# EAGLE design axiom_beta_plugin_module_3xPMOD (EAGLE 7.0.0)
Assembly variants: Beta
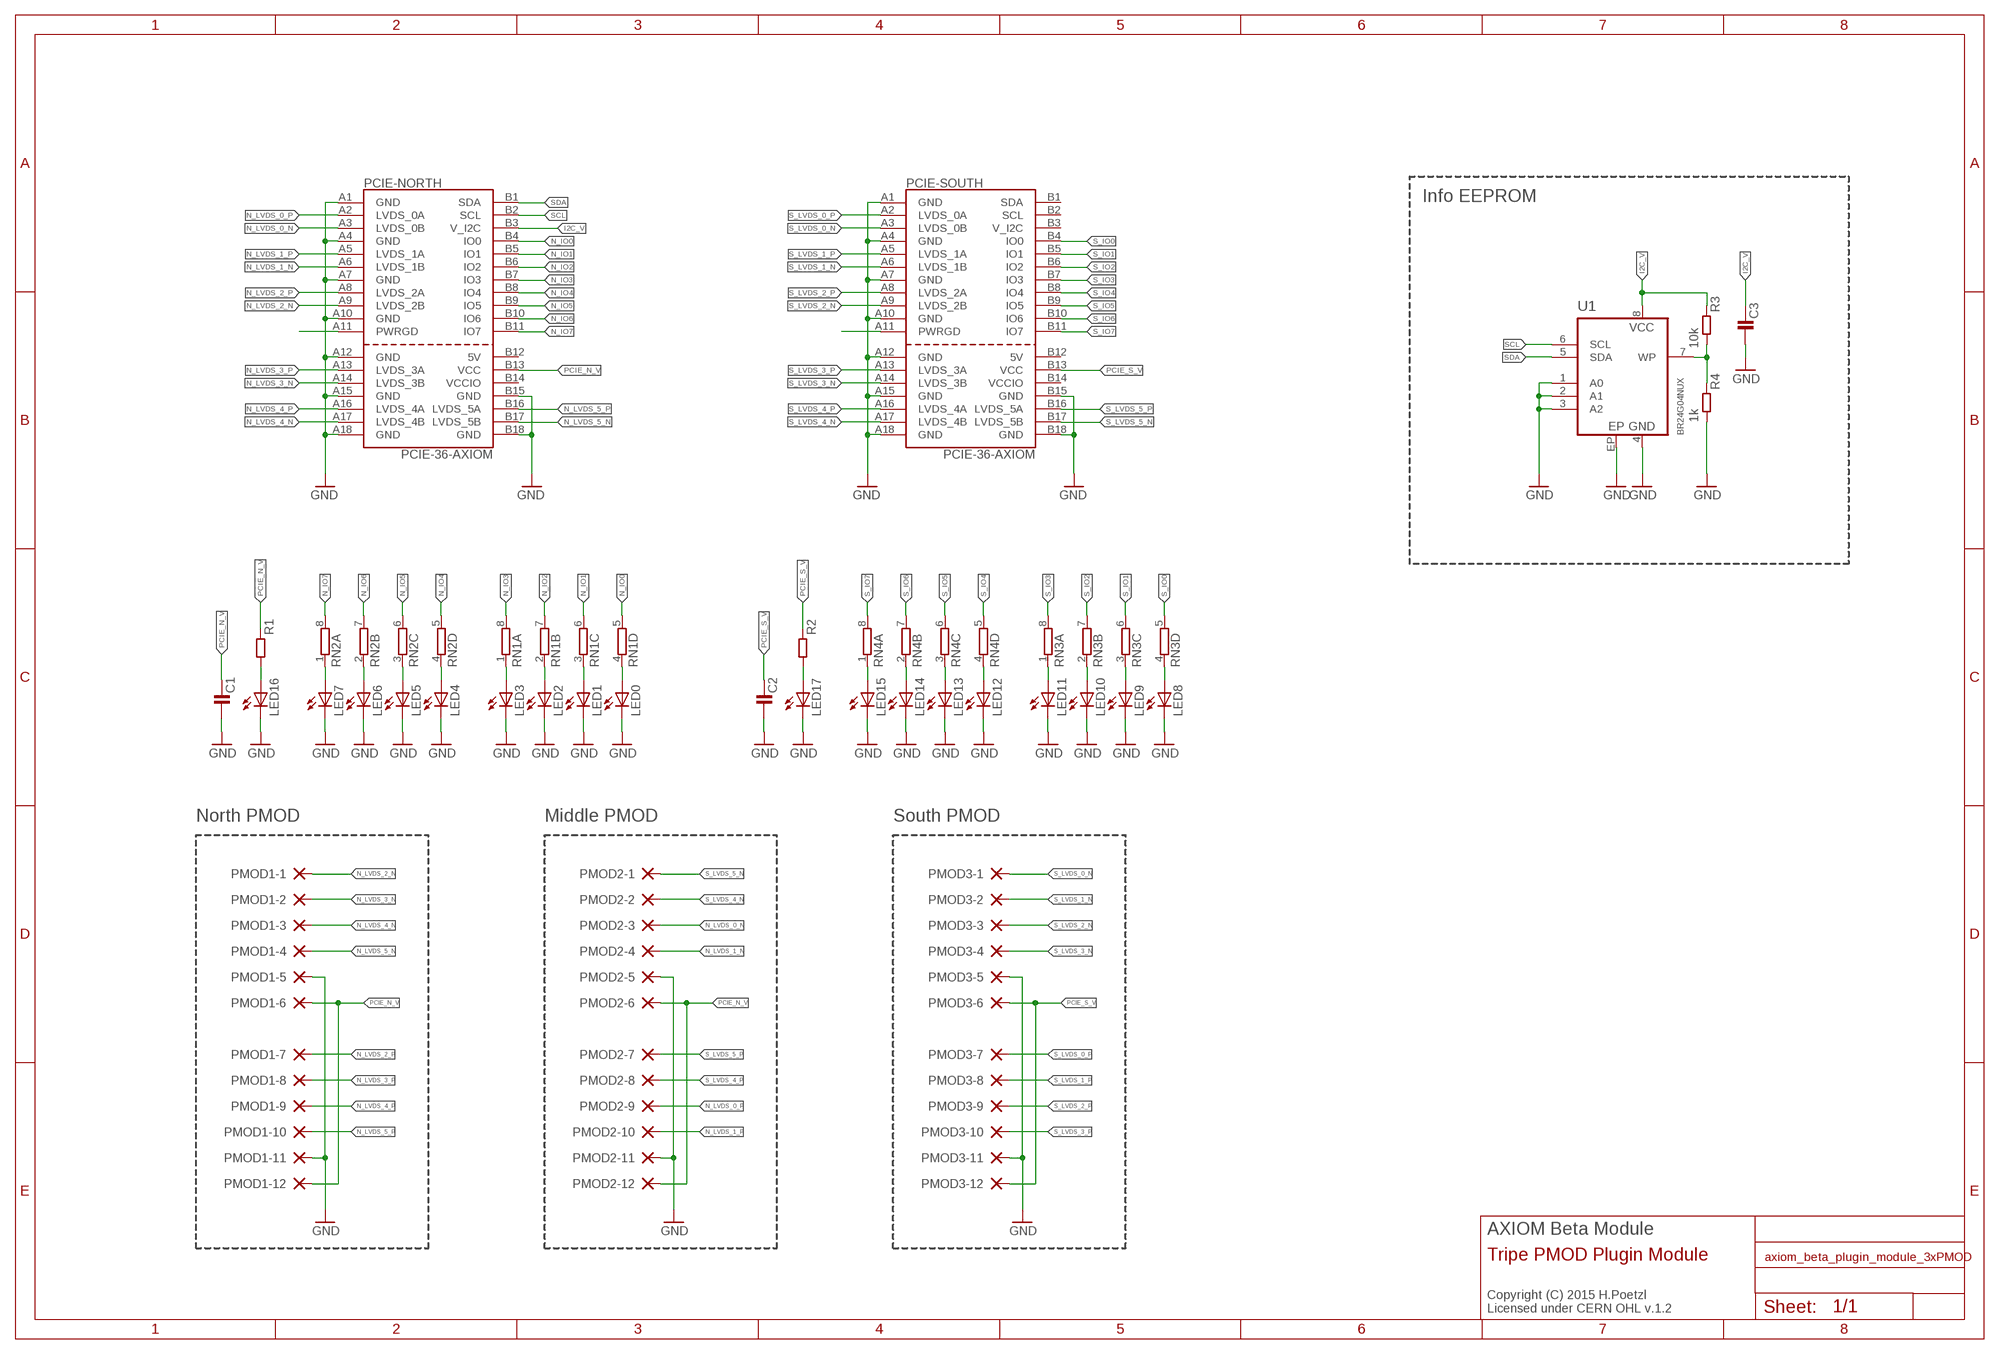
[diagram p0: schematic, sheet 1]

## Parts
C1  C1206-A  [1206-A]
C2  C1206-A  [1206-A]
C3  C0402-B  [0402-B]
LED0  LEDCHIPLED_0603  [CHIPLED_0603]
LED1  LEDCHIPLED_0603  [CHIPLED_0603]
LED2  LEDCHIPLED_0603  [CHIPLED_0603]
LED3  LEDCHIPLED_0603  [CHIPLED_0603]
LED4  LEDCHIPLED_0603  [CHIPLED_0603]
LED5  LEDCHIPLED_0603  [CHIPLED_0603]
LED6  LEDCHIPLED_0603  [CHIPLED_0603]
LED7  LEDCHIPLED_0603  [CHIPLED_0603]
LED8  LEDCHIPLED_0603  [CHIPLED_0603]
LED9  LEDCHIPLED_0603  [CHIPLED_0603]
LED10  LEDCHIPLED_0603  [CHIPLED_0603]
LED11  LEDCHIPLED_0603  [CHIPLED_0603]
LED12  LEDCHIPLED_0603  [CHIPLED_0603]
LED13  LEDCHIPLED_0603  [CHIPLED_0603]
LED14  LEDCHIPLED_0603  [CHIPLED_0603]
LED15  LEDCHIPLED_0603  [CHIPLED_0603]
LED16  LEDCHIPLED_0603  [CHIPLED_0603]
LED17  LEDCHIPLED_0603  [CHIPLED_0603]
PCIE-NORTH  PCIE-36-AXIOM  [PCIE-36-AXIOM]  (not fitted in variant Beta)
PCIE-SOUTH  PCIE-36-AXIOM  [PCIE-36-AXIOM]  (not fitted in variant Beta)
PMOD1-1  SMD-PAD1.6X3.8MM-U  [1.6X3.8U-MM]  (not fitted in variant Beta)
PMOD1-2  SMD-PAD1.6X3.8MM-U  [1.6X3.8U-MM]  (not fitted in variant Beta)
PMOD1-3  SMD-PAD1.6X3.8MM-U  [1.6X3.8U-MM]  (not fitted in variant Beta)
PMOD1-4  SMD-PAD1.6X3.8MM-U  [1.6X3.8U-MM]  (not fitted in variant Beta)
PMOD1-5  SMD-PAD1.6X3.8MM-U  [1.6X3.8U-MM]  (not fitted in variant Beta)
PMOD1-6  SMD-PAD1.6X3.8MM-U  [1.6X3.8U-MM]  (not fitted in variant Beta)
PMOD1-7  SMD-PAD1.6X3.8MM-U  [1.6X3.8U-MM]  (not fitted in variant Beta)
PMOD1-8  SMD-PAD1.6X3.8MM-U  [1.6X3.8U-MM]  (not fitted in variant Beta)
PMOD1-9  SMD-PAD1.6X3.8MM-U  [1.6X3.8U-MM]  (not fitted in variant Beta)
PMOD1-10  SMD-PAD1.6X3.8MM-U  [1.6X3.8U-MM]  (not fitted in variant Beta)
PMOD1-11  SMD-PAD1.6X3.8MM-U  [1.6X3.8U-MM]  (not fitted in variant Beta)
PMOD1-12  SMD-PAD1.6X3.8MM-U  [1.6X3.8U-MM]  (not fitted in variant Beta)
PMOD2-1  SMD-PAD1.6X3.8MM-U  [1.6X3.8U-MM]  (not fitted in variant Beta)
PMOD2-2  SMD-PAD1.6X3.8MM-U  [1.6X3.8U-MM]  (not fitted in variant Beta)
PMOD2-3  SMD-PAD1.6X3.8MM-U  [1.6X3.8U-MM]  (not fitted in variant Beta)
PMOD2-4  SMD-PAD1.6X3.8MM-U  [1.6X3.8U-MM]  (not fitted in variant Beta)
PMOD2-5  SMD-PAD1.6X3.8MM-U  [1.6X3.8U-MM]  (not fitted in variant Beta)
PMOD2-6  SMD-PAD1.6X3.8MM-U  [1.6X3.8U-MM]  (not fitted in variant Beta)
PMOD2-7  SMD-PAD1.6X3.8MM-U  [1.6X3.8U-MM]  (not fitted in variant Beta)
PMOD2-8  SMD-PAD1.6X3.8MM-U  [1.6X3.8U-MM]  (not fitted in variant Beta)
PMOD2-9  SMD-PAD1.6X3.8MM-U  [1.6X3.8U-MM]  (not fitted in variant Beta)
PMOD2-10  SMD-PAD1.6X3.8MM-U  [1.6X3.8U-MM]  (not fitted in variant Beta)
PMOD2-11  SMD-PAD1.6X3.8MM-U  [1.6X3.8U-MM]  (not fitted in variant Beta)
PMOD2-12  SMD-PAD1.6X3.8MM-U  [1.6X3.8U-MM]  (not fitted in variant Beta)
PMOD3-1  SMD-PAD1.6X3.8MM-U  [1.6X3.8U-MM]  (not fitted in variant Beta)
PMOD3-2  SMD-PAD1.6X3.8MM-U  [1.6X3.8U-MM]  (not fitted in variant Beta)
PMOD3-3  SMD-PAD1.6X3.8MM-U  [1.6X3.8U-MM]  (not fitted in variant Beta)
PMOD3-4  SMD-PAD1.6X3.8MM-U  [1.6X3.8U-MM]  (not fitted in variant Beta)
PMOD3-5  SMD-PAD1.6X3.8MM-U  [1.6X3.8U-MM]  (not fitted in variant Beta)
PMOD3-6  SMD-PAD1.6X3.8MM-U  [1.6X3.8U-MM]  (not fitted in variant Beta)
PMOD3-7  SMD-PAD1.6X3.8MM-U  [1.6X3.8U-MM]  (not fitted in variant Beta)
PMOD3-8  SMD-PAD1.6X3.8MM-U  [1.6X3.8U-MM]  (not fitted in variant Beta)
PMOD3-9  SMD-PAD1.6X3.8MM-U  [1.6X3.8U-MM]  (not fitted in variant Beta)
PMOD3-10  SMD-PAD1.6X3.8MM-U  [1.6X3.8U-MM]  (not fitted in variant Beta)
PMOD3-11  SMD-PAD1.6X3.8MM-U  [1.6X3.8U-MM]  (not fitted in variant Beta)
PMOD3-12  SMD-PAD1.6X3.8MM-U  [1.6X3.8U-MM]  (not fitted in variant Beta)
R1  R0402-B  [0402-B]
R2  R0402-B  [0402-B]
R3  10k  R0402-B  [0402-B]
R4  1k  R0402-B  [0402-B]
RN1  4R-NCAY16  [CAY16]
RN2  4R-NCAY16  [CAY16]
RN3  4R-NCAY16  [CAY16]
RN4  4R-NCAY16  [CAY16]
U1  BR24G04NUX  [DFN200X300X100-9N]

## Nets
GND: C1.2 C2.2 C3.2 LED0.C LED1.C LED2.C LED3.C LED4.C LED5.C LED6.C LED7.C LED8.C LED9.C LED10.C LED11.C LED12.C LED13.C LED14.C LED15.C LED16.C LED17.C PCIE-NORTH.A1(GND) PCIE-NORTH.A4(GND) PCIE-NORTH.A7(GND) PCIE-NORTH.A10(GND) PCIE-NORTH.A12(GND) PCIE-NORTH.A15(GND) PCIE-NORTH.A18(GND) PCIE-NORTH.B15(GND) PCIE-NORTH.B18(GND) PCIE-SOUTH.A1(GND) PCIE-SOUTH.A4(GND) PCIE-SOUTH.A7(GND) PCIE-SOUTH.A10(GND) PCIE-SOUTH.A12(GND) PCIE-SOUTH.A15(GND) PCIE-SOUTH.A18(GND) PCIE-SOUTH.B15(GND) PCIE-SOUTH.B18(GND) PMOD1-5.1(P) PMOD1-11.1(P) PMOD2-5.1(P) PMOD2-11.1(P) PMOD3-5.1(P) PMOD3-11.1(P) R4.2 U1.1(A0) U1.2(A1) U1.3(A2) U1.4(GND) U1.EP
I2C_V: C3.1 PCIE-NORTH.B3(V_I2C) R3.1 U1.8(VCC)
N$196: LED3.A RN1.1
N$197: LED2.A RN1.2
N$198: LED1.A RN1.3
N$202: LED0.A RN1.4
N$209: PCIE-NORTH.A11(PWRGD)
N$211: LED16.A R1.2
N$214: LED17.A R2.2
N$216: R3.2 R4.1 U1.7(WP)
N$256: PCIE-SOUTH.A11(PWRGD)
N$275: LED7.A RN2.1
N$276: LED6.A RN2.2
N$277: LED5.A RN2.3
N$278: LED4.A RN2.4
N$322: LED11.A RN3.1
N$323: LED10.A RN3.2
N$324: LED9.A RN3.3
N$325: LED8.A RN3.4
N$369: LED15.A RN4.1
N$370: LED14.A RN4.2
N$371: LED13.A RN4.3
N$372: LED12.A RN4.4
N_IO0: PCIE-NORTH.B4(IO0) RN1.5
N_IO1: PCIE-NORTH.B5(IO1) RN1.6
N_IO2: PCIE-NORTH.B6(IO2) RN1.7
N_IO3: PCIE-NORTH.B7(IO3) RN1.8
N_IO4: PCIE-NORTH.B8(IO4) RN2.5
N_IO5: PCIE-NORTH.B9(IO5) RN2.6
N_IO6: PCIE-NORTH.B10(IO6) RN2.7
N_IO7: PCIE-NORTH.B11(IO7) RN2.8
N_LVDS_0_N: PCIE-NORTH.A3(LVDS_0B) PMOD2-3.1(P)
N_LVDS_0_P: PCIE-NORTH.A2(LVDS_0A) PMOD2-9.1(P)
N_LVDS_1_N [LVDS]: PCIE-NORTH.A6(LVDS_1B) PMOD2-4.1(P)
N_LVDS_1_P [LVDS]: PCIE-NORTH.A5(LVDS_1A) PMOD2-10.1(P)
N_LVDS_2_N [LVDS]: PCIE-NORTH.A9(LVDS_2B) PMOD1-1.1(P)
N_LVDS_2_P [LVDS]: PCIE-NORTH.A8(LVDS_2A) PMOD1-7.1(P)
N_LVDS_3_N: PCIE-NORTH.A14(LVDS_3B) PMOD1-2.1(P)
N_LVDS_3_P: PCIE-NORTH.A13(LVDS_3A) PMOD1-8.1(P)
N_LVDS_4_N [LVDS]: PCIE-NORTH.A17(LVDS_4B) PMOD1-3.1(P)
N_LVDS_4_P [LVDS]: PCIE-NORTH.A16(LVDS_4A) PMOD1-9.1(P)
N_LVDS_5_N [LVDS]: PCIE-NORTH.B17(LVDS_5B) PMOD1-4.1(P)
N_LVDS_5_P [LVDS]: PCIE-NORTH.B16(LVDS_5A) PMOD1-10.1(P)
PCIE_N_V: C1.1 PCIE-NORTH.B13(VCC) PMOD1-6.1(P) PMOD1-12.1(P) PMOD2-6.1(P) PMOD2-12.1(P) R1.1
PCIE_S_V: C2.1 PCIE-SOUTH.B13(VCC) PMOD3-6.1(P) PMOD3-12.1(P) R2.1
S_IO0: PCIE-SOUTH.B4(IO0) RN3.5
S_IO1: PCIE-SOUTH.B5(IO1) RN3.6
S_IO2: PCIE-SOUTH.B6(IO2) RN3.7
S_IO3: PCIE-SOUTH.B7(IO3) RN3.8
S_IO4: PCIE-SOUTH.B8(IO4) RN4.5
S_IO5: PCIE-SOUTH.B9(IO5) RN4.6
S_IO6: PCIE-SOUTH.B10(IO6) RN4.7
S_IO7: PCIE-SOUTH.B11(IO7) RN4.8
S_LVDS_0_N [LVDS]: PCIE-SOUTH.A3(LVDS_0B) PMOD3-1.1(P)
S_LVDS_0_P [LVDS]: PCIE-SOUTH.A2(LVDS_0A) PMOD3-7.1(P)
S_LVDS_1_N: PCIE-SOUTH.A6(LVDS_1B) PMOD3-2.1(P)
S_LVDS_1_P: PCIE-SOUTH.A5(LVDS_1A) PMOD3-8.1(P)
S_LVDS_2_N [LVDS]: PCIE-SOUTH.A9(LVDS_2B) PMOD3-3.1(P)
S_LVDS_2_P [LVDS]: PCIE-SOUTH.A8(LVDS_2A) PMOD3-9.1(P)
S_LVDS_3_N [LVDS]: PCIE-SOUTH.A14(LVDS_3B) PMOD3-4.1(P)
S_LVDS_3_P [LVDS]: PCIE-SOUTH.A13(LVDS_3A) PMOD3-10.1(P)
S_LVDS_4_N [LVDS]: PCIE-SOUTH.A17(LVDS_4B) PMOD2-2.1(P)
S_LVDS_4_P [LVDS]: PCIE-SOUTH.A16(LVDS_4A) PMOD2-8.1(P)
S_LVDS_5_N [LVDS]: PCIE-SOUTH.B17(LVDS_5B) PMOD2-1.1(P)
S_LVDS_5_P [LVDS]: PCIE-SOUTH.B16(LVDS_5A) PMOD2-7.1(P)
SCL: PCIE-NORTH.B2(SCL) U1.6(SCL)
SDA: PCIE-NORTH.B1(SDA) U1.5(SDA)
Unconnected: PCIE-NORTH.B12(5V) PCIE-NORTH.B14(VCCIO) PCIE-SOUTH.B1(SDA) PCIE-SOUTH.B2(SCL) PCIE-SOUTH.B3(V_I2C) PCIE-SOUTH.B12(5V) PCIE-SOUTH.B14(VCCIO)

## Notes on the sheet
- Info EEPROM
- North PMOD | Middle PMOD | South PMOD
- AXIOM Beta Module
- Tripe PMOD Plugin Module
- Copyright (C) 2015 H.Poetzl
  Licensed under CERN OHL v.1.2

## Library data of the parts
C1-C3 = generic-rcl:C
LED0 LED1-LED17 = led:LED: LED OSRAM: - CHIPLED LG R971, LG N971, LY N971, LG Q971, LY Q971, LO R971, LY R971 LH N974, LH R974 LS Q976, LO Q976, LY Q976 LO Q996 - Hyper CHIPLED LW Q18S LB Q993, LB Q99A, LB R99A - SideLED LS A670, LO A670, LY A670, LG A670, LP A670 LB A673, LV A673, LT A673, LW A673 LH A674 LY A675 LS A676, LA A676, LO A676, LY A676, LW A676 LS A679, LY A679, LG A679 - Hyper Micro SIDELED® LS Y876, LA Y876, LO Y876, LY Y876 LT Y87S - SmartLED LW L88C, LW L88S LB L89C, LB L89S, LG L890 LS L89K, LO L89K, LY L89K LS L896, LA L896, LO L896, LY L896 - TOPLED LS T670, LO T670, LY T670, LG T670, LP T670 LSG T670, LSP T670, LSY T670, LOP T670, LYG T670 LG T671, LOG T671, LSG T671 LB T673, LV T673, LT T673, LW T673 LH T674 LS T676, LA T676, LO T676, LY T676, LB T676, LH T676, LSB T676, LW T676 LB T67C, LV T67C, LT T67C, LS T67K, LO T67K, LY T67K, LW E67C LS E67B, LA E67B, LO E67B, LY E67B, LB E67C, LV E67C, LT E67C LW T67C LS T679, LY T679, LG T679 LS T770, LO T770, LY T770, LG T770, LP T770 LB T773, LV T773, LT T773, LW T773 LH T774 LS E675, LA E675, LY E675, LS T675 LS T776, LA T776, LO T776, LY T776, LB T776 LHGB T686 LT T68C, LB T68C - Hyper Mini TOPLED® LB M676 - Mini TOPLED Santana® LG M470 LS M47K, LO M47K, LY M47K Source: http://www.osram.convergy.de LUXEON: - LUMILED® LXK2-PW12-R00, LXK2-PW12-S00, LXK2-PW14-U00, LXK2-PW14-V00 LXK2-PM12-R00, LXK2-PM12-S00, LXK2-PM14-U00 LXK2-PE12-Q00, LXK2-PE12-R00, LXK2-PE12-S00, LXK2-PE14-T00, LXK2-PE14-U00 LXK2-PB12-K00, LXK2-PB12-L00, LXK2-PB12-M00, LXK2-PB14-N00, LXK2-PB14-P00, LXK2-PB14-Q00 LXK2-PR12-L00, LXK2-PR12-M00, LXK2-PR14-Q00, LXK2-PR14-R00 LXK2-PD12-Q00, LXK2-PD12-R00, LXK2-PD12-S00 LXK2-PH12-R00, LXK2-PH12-S00 LXK2-PL12-P00, LXK2-PL12-Q00, LXK2-PL12-R00 Source: www.luxeon.com KINGBRIGHT: KA-3528ASYC Source: www.kingbright.com
PCIE-NORTH PCIE-SOUTH = PCIe:PCIE-36-AXIOM
PMOD1-1-PMOD1-12 PMOD2-1-PMOD2-12 PMOD3-1-PMOD3-12 = smd_pads:SMD-PAD: SMD PAD
R1-R4 = generic-rcl:R
RN1-RN4 = resistor-dil:4R-N: Array Chip Resistor Source: RS Component / Phycomp; OC_FARNELL: unknown; OC_NEWARK: unknown
U1 = eeprom:BR24G04

## Net classes
0 default: width 0.152 mm, drill 0.254 mm, clearance 0.152 mm
1 LVDS: width 0.152 mm, drill 0.254 mm, clearance 0.152 mm

## Board
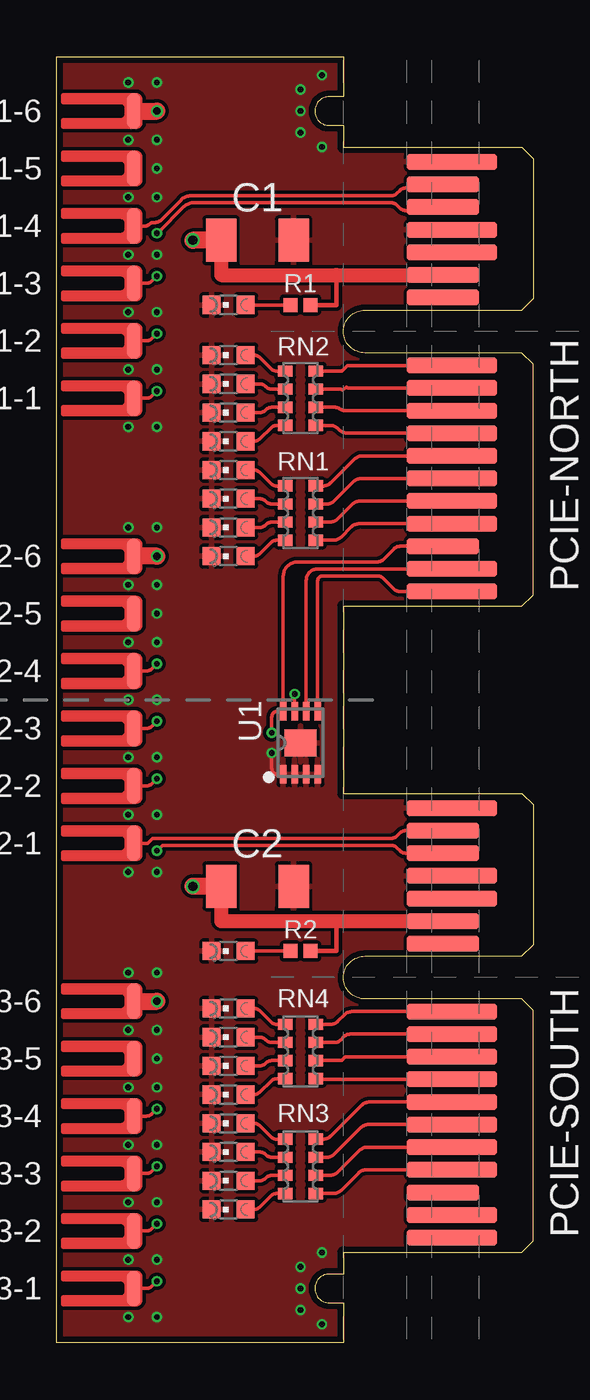
[diagram p1: board, top side]
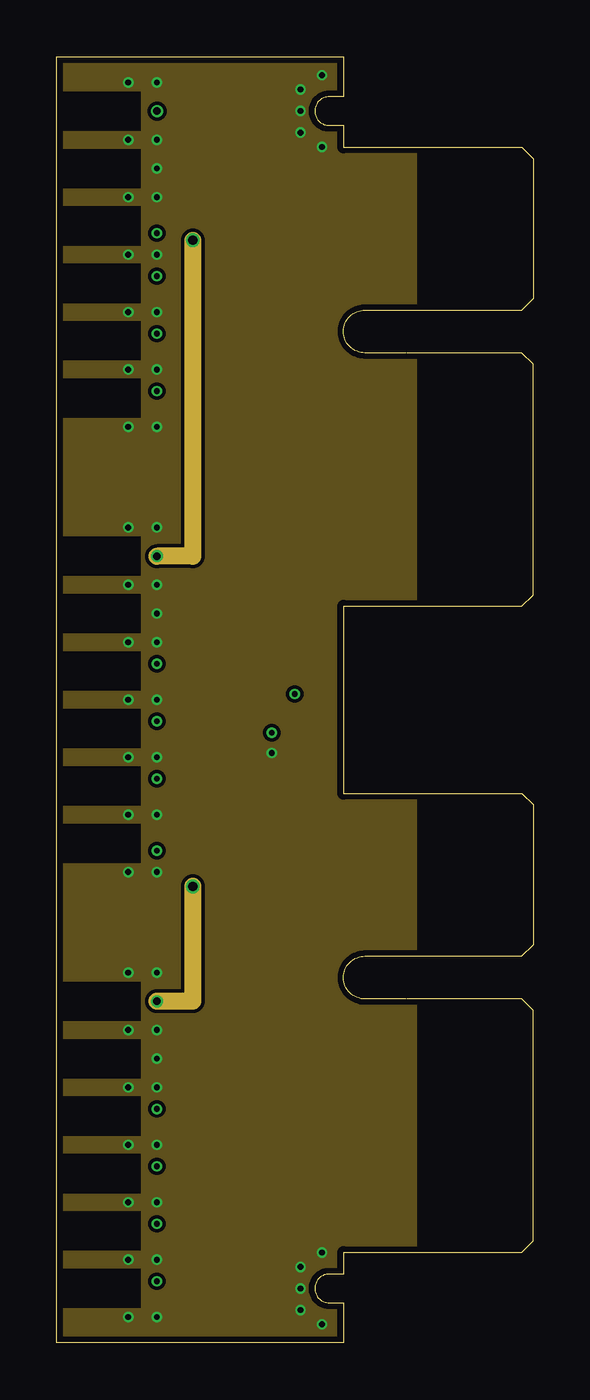
[diagram p2: board, inner layer Route2]
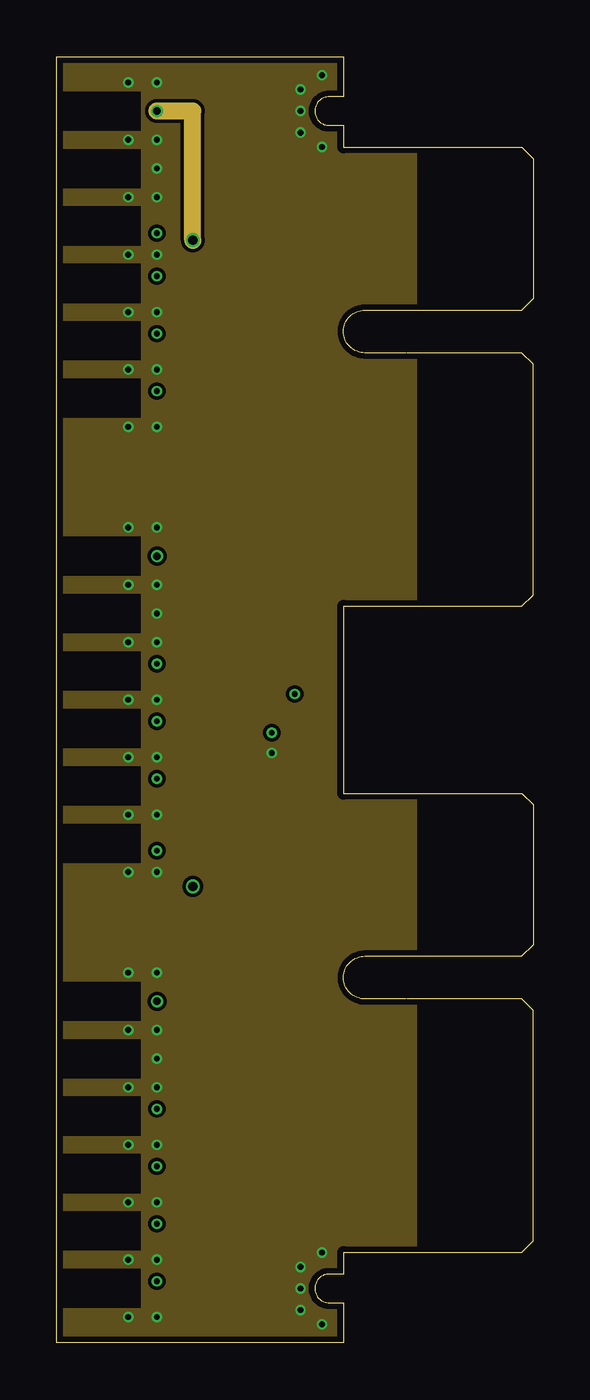
[diagram p3: board, inner layer Route15]
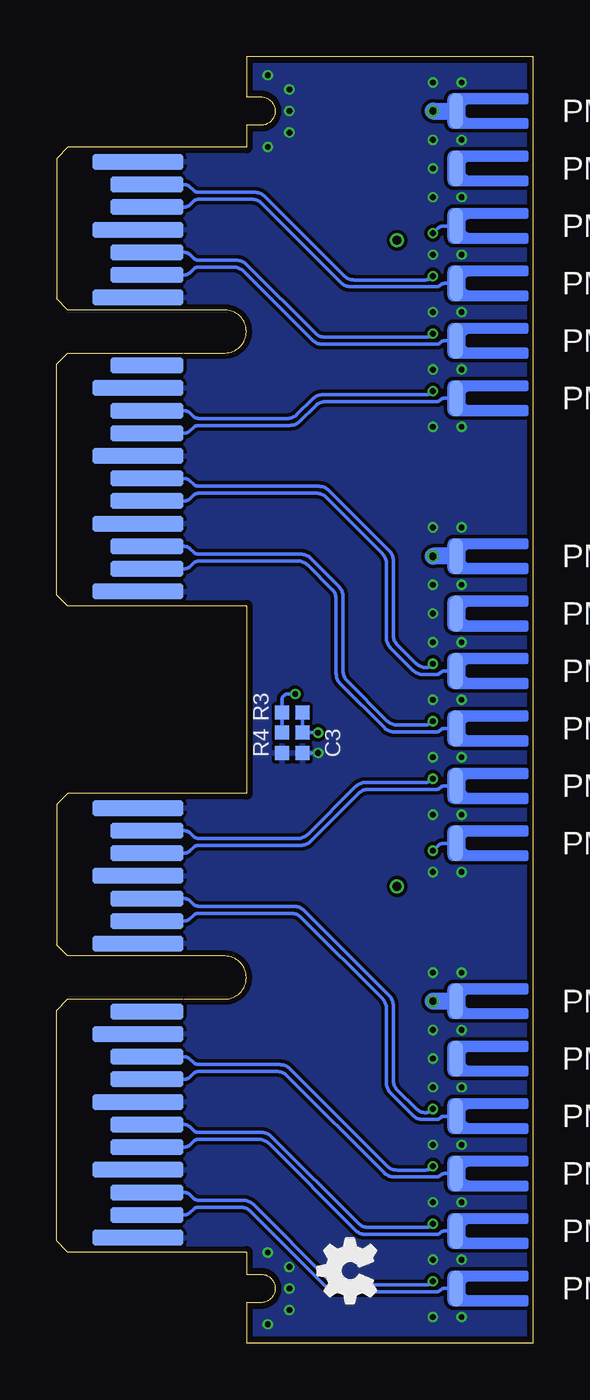
[diagram p4: board, bottom side, seen from below]

Size 21.1 x 56.9 mm. Coordinates in mm from the lower left corner, seen from the top.
Outline: 12.7,32.59 12.7,24.31
Outline: 0,18.92 0,37.97
Outline: 12.7,52.89 12.7,53.85 12.06,53.85 arc-90 11.43,54.48 arc-90 12.06,55.12 12.7,55.12 12.7,56.9 0,56.9 0,0 12.7,0 12.7,1.78 12.06,1.78 arc-90 11.43,2.41 arc-90 12.06,3.05 12.7,3.05 12.7,4.01
Copper layers (1*2*15*16): Top 0.035559375mm / dielectric 0.17018125mm / Route2 0.01778125mm / dielectric 47mil / Route15 0.01778125mm / dielectric 0.17018125mm / Bottom 0.035559375mm
Design rules "OSHPark-4layer-tuned *": minimum track width 5mil, minimum drill 10mil, track to track 6mil, track to pad 5mil, pad to pad 5mil, via to via 5mil, smd to smd 5mil, copper to edge 10mil, drill to drill 6mil, minimum pad ring 4mil, minimum via ring 4mil, stop-mask expansion 2mil, vias tented up to drill 16mil, thermal gap 6mil
tKeepout: area 10.5,52.9 to 13.7,56.1; area 10.5,0.8 to 13.7,4
bKeepout: area 10.5,52.9 to 13.7,56.1; area 10.5,0.8 to 13.7,4

### Footprints (pad centres in the part's own frame; a part is rotated, then mirrored left to right if it is on the bottom)
1206-A = smd 1.35 x 1.9: 1 -1.6,0; 2 1.6,0
0402-B = smd 0.62 x 0.62: 1 -0.45,0; 2 0.45,0
CHIPLED_0603 = smd 0.8 x 0.8: A 0,-0.75; C 0,0.75
PCIE-36-AXIOM = smd 0.7 x 4 bottom: A1 -11.5,3.6; A4 -8.5,3.6; A7 -5.5,3.6; A10 -2.5,3.6; A12 1.5,3.6; A15 4.5,3.6; A18 7.5,3.6 | smd 0.7 x 3.2 bottom: A2 -10.5,4; A3 -9.5,4; A5 -7.5,4; A6 -6.5,4; A8 -4.5,4; A9 -3.5,4; A11 -1.5,4; A13 2.5,4; A14 3.5,4; A16 5.5,4; A17 6.5,4 | smd 0.7 x 4: B1 -11.5,3.6; B2 -10.5,3.6; B4 -8.5,3.6; B5 -7.5,3.6; B6 -6.5,3.6; B7 -5.5,3.6; B8 -4.5,3.6; B9 -3.5,3.6; B10 -2.5,3.6; B11 -1.5,3.6; B14 3.5,3.6; B15 4.5,3.6; B18 7.5,3.6 | smd 0.7 x 3.2: B3 -9.5,4; B12 1.5,4; B13 2.5,4; B16 5.5,4; B17 6.5,4
1.6X3.8U-MM = smd 1.6 x 0.6: 1 0,-1.5
CAY16 = smd 0.5 x 0.65: 1 -1.2,-0.675; 2 -0.4,-0.675; 3 0.4,-0.675; 4 1.2,-0.675; 5 1.2,0.675; 6 0.4,0.675; 7 -0.4,0.675; 8 -1.2,0.675
DFN200X300X100-9N = smd 0.813 x 0.305: 1 -1.397,0.762; 2 -1.397,0.254; 3 -1.397,-0.254; 4 -1.397,-0.762; 5 1.397,-0.762; 6 1.397,-0.254; 7 1.397,0.254; 8 1.397,0.762 | smd 1.194 x 1.397: EP 0,0

### Placement (x,y rotation side)
C1  8.89,48.77 0 top
C2  8.89,20.19 0 top
C3  10.22,26.54 270 bottom
LED0  7.62,34.8 90 top
LED1  7.62,36.07 90 top
LED2  7.62,37.34 90 top
LED3  7.62,38.61 90 top
LED4  7.62,39.88 90 top
LED5  7.62,41.15 90 top
LED6  7.62,42.42 90 top
LED7  7.62,43.69 90 top
LED8  7.62,5.91 90 top
LED9  7.62,7.18 90 top
LED10  7.62,8.45 90 top
LED11  7.62,9.72 90 top
LED12  7.62,10.99 90 top
LED13  7.62,12.26 90 top
LED14  7.62,13.53 90 top
LED15  7.62,14.8 90 top
LED16  7.62,45.91 90 top
LED17  7.62,17.34 90 top
LOGO1  OSHW_LOGO_FILLX0100-NT  [OSHW_FILLX100_NOTEXT]  6.98,1.78 90 bottom
PCIE-NORTH  21.1,44.74 90 top  (not fitted)
PCIE-SOUTH  21.1,16.16 90 top  (not fitted)
PMOD1-1  1.9,41.78 90 top  (not fitted)
PMOD1-2  1.9,44.32 90 top  (not fitted)
PMOD1-3  1.9,46.86 90 top  (not fitted)
PMOD1-4  1.9,49.4 90 top  (not fitted)
PMOD1-5  1.9,51.94 90 top  (not fitted)
PMOD1-6  1.9,54.48 90 top  (not fitted)
PMOD1-7  1.9,41.78 270 bottom  (not fitted)
PMOD1-8  1.9,44.32 270 bottom  (not fitted)
PMOD1-9  1.9,46.86 270 bottom  (not fitted)
PMOD1-10  1.9,49.4 270 bottom  (not fitted)
PMOD1-11  1.9,51.94 270 bottom  (not fitted)
PMOD1-12  1.9,54.48 270 bottom  (not fitted)
PMOD2-1  1.9,22.1 90 top  (not fitted)
PMOD2-2  1.9,24.64 90 top  (not fitted)
PMOD2-3  1.9,27.18 90 top  (not fitted)
PMOD2-4  1.9,29.72 90 top  (not fitted)
PMOD2-5  1.9,32.26 90 top  (not fitted)
PMOD2-6  1.9,34.8 90 top  (not fitted)
PMOD2-7  1.9,22.1 270 bottom  (not fitted)
PMOD2-8  1.9,24.64 270 bottom  (not fitted)
PMOD2-9  1.9,27.18 270 bottom  (not fitted)
PMOD2-10  1.9,29.72 270 bottom  (not fitted)
PMOD2-11  1.9,32.26 270 bottom  (not fitted)
PMOD2-12  1.9,34.8 270 bottom  (not fitted)
PMOD3-1  1.9,2.41 90 top  (not fitted)
PMOD3-2  1.9,4.95 90 top  (not fitted)
PMOD3-3  1.9,7.49 90 top  (not fitted)
PMOD3-4  1.9,10.03 90 top  (not fitted)
PMOD3-5  1.9,12.57 90 top  (not fitted)
PMOD3-6  1.9,15.11 90 top  (not fitted)
PMOD3-7  1.9,2.41 270 bottom  (not fitted)
PMOD3-8  1.9,4.95 270 bottom  (not fitted)
PMOD3-9  1.9,7.49 270 bottom  (not fitted)
PMOD3-10  1.9,10.03 270 bottom  (not fitted)
PMOD3-11  1.9,12.57 270 bottom  (not fitted)
PMOD3-12  1.9,15.11 270 bottom  (not fitted)
R1  10.79,45.91 180 top
R2  10.79,17.34 180 top
R3  10.67,27.88 180 bottom
R4  11.11,26.54 270 bottom
RN1  10.79,36.7 270 top
RN2  10.79,41.78 270 top
RN3  10.79,7.81 270 top
RN4  10.79,12.89 270 top
U1  10.79,26.54 90 top

### Tracks (layer width: path | path; a pad name or v marks a point on that pad's centre or on a via)
GND  (via drill 0.25)
  Top 0.152: U1.1 9.78,25.15 arc-90 9.52,25.4 v9.52,26.09
  Bottom 0.152: v9.52,26.09 C3.2
  other vias: 4.44,23.37 4.44,25.91 4.44,20.83 4.44,28.45 4.44,30.99 4.44,32.26 4.44,33.53 4.44,36.07 3.17,23.37 3.17,20.83 3.17,25.91 3.17,28.45 3.17,30.99 3.17,33.53 3.17,36.07 4.44,3.68 4.44,6.22 4.44,1.14 4.44,8.76 4.44,11.3 4.44,12.57 4.44,13.84 4.44,16.38 3.17,3.68 3.17,1.14 3.17,6.22 3.17,8.76 3.17,11.3 3.17,13.84 3.17,16.38 4.44,43.05 4.44,45.59 4.44,40.51 4.44,48.13 4.44,50.67 4.44,51.94 4.44,53.21 4.44,55.75 3.17,43.05 3.17,40.51 3.17,45.59 3.17,48.13 3.17,50.67 3.17,53.21 3.17,55.75 11.75,0.83 10.79,1.46 10.79,2.41 10.79,3.37 11.75,4 11.75,56.07 11.75,52.9 10.79,53.53 10.79,55.44 10.79,54.48
  pour Top (isolate 0.152): 0,56.9 12.7,56.9 12.7,53.21 15.88,53.21 15.88,3.68 12.7,3.68 12.7,0 0,0
  pour Bottom (isolate 0.152): 0,56.9 12.7,56.9 12.7,53.21 15.88,53.21 15.88,3.68 12.7,3.68 12.7,0 0,0
  pour Route2 (isolate 0.152): 0,56.9 12.7,56.9 12.7,53.21 15.88,53.21 15.88,3.68 12.7,3.68 12.7,0 0,0 0,1.46 3.81,1.46 3.81,3.37 0,3.37 0,4 3.81,4 3.81,5.91 0,5.91 0,6.54 3.81,6.54 3.81,8.45 0,8.45 0,9.08 3.81,9.08 3.81,10.99 0,10.99 0,11.62 3.81,11.62 3.81,13.53 0,13.53 0,14.16 3.81,14.16 3.81,16.07 0,16.07 0,21.15 3.81,21.15 3.81,23.05 0,23.05 0,23.69 3.81,23.69 3.81,25.59 0,25.59 0,26.23 3.81,26.23 3.81,28.13 0,28.13 0,28.77 3.81,28.77 3.81,30.67 0,30.67 0,31.31 3.81,31.31 3.81,33.21 0,33.21 0,33.85 3.81,33.85 3.81,35.75 0,35.75 0,40.83 3.81,40.83 3.81,42.74 0,42.74 0,43.37 3.81,43.37 3.81,45.28 0,45.28 0,45.91 3.81,45.91 3.81,47.82 0,47.82 0,48.45 3.81,48.45 3.81,50.36 0,50.36 0,50.99 3.81,50.99 3.81,52.9 0,52.9 0,53.53 3.81,53.53 3.81,55.44 0,55.44
  pour Route15 (isolate 0.152): 0,56.9 12.7,56.9 12.7,53.21 15.88,53.21 15.88,3.68 12.7,3.68 12.7,0 0,0 0,1.46 3.81,1.46 3.81,3.37 0,3.37 0,4 3.81,4 3.81,5.91 0,5.91 0,6.54 3.81,6.54 3.81,8.45 0,8.45 0,9.08 3.81,9.08 3.81,10.99 0,10.99 0,11.62 3.81,11.62 3.81,13.53 0,13.53 0,14.16 3.81,14.16 3.81,16.07 0,16.07 0,21.15 3.81,21.15 3.81,23.05 0,23.05 0,23.69 3.81,23.69 3.81,25.59 0,25.59 0,26.23 3.81,26.23 3.81,28.13 0,28.13 0,28.77 3.81,28.77 3.81,30.67 0,30.67 0,31.31 3.81,31.31 3.81,33.21 0,33.21 0,33.85 3.81,33.85 3.81,35.75 0,35.75 0,40.83 3.81,40.83 3.81,42.74 0,42.74 0,43.37 3.81,43.37 3.81,45.28 0,45.28 0,45.91 3.81,45.91 3.81,47.82 0,47.82 0,48.45 3.81,48.45 3.81,50.36 0,50.36 0,50.99 3.81,50.99 3.81,52.9 0,52.9 0,53.53 3.81,53.53 3.81,55.44 0,55.44
I2C_V  (via drill 0.25)
  Top 0.152: v9.52,26.99 9.52,27.69 arc-90 9.78,27.94 U1.8 10.03,33.91 arc-90 10.67,34.54 14.19,34.54 arc45 14.46,34.66 14.93,35.12 arc-45 15.2,35.23 PCIE-NORTH.B3
  Bottom 0.152: v9.52,26.99 C3.1 R3.1
N$196
  Top 0.152: RN1.1 9.75,37.9 arc-45 9.48,38.02 9,38.5 arc45 8.73,38.61 LED3.A
N$197
  Top 0.152: RN1.2 9.54,37.1 arc-45 9.27,37.22 9.26,37.23 arc45 8.99,37.34 LED2.A
N$198
  Top 0.152: RN1.3 9.54,36.3 arc45 9.27,36.19 9.26,36.18 arc-45 8.99,36.07 LED1.A
N$202
  Top 0.152: RN1.4 9.75,35.5 arc45 9.48,35.39 9,34.91 arc-45 8.73,34.8 LED0.A
N$211
  Top 0.152: LED16.A R1.2
N$214
  Top 0.152: LED17.A R2.2
N$216  (via drill 0.25)
  Top 0.152: U1.7 v10.54,28.7
  Bottom 0.152: R4.1 R3.2 11.12,28.45 arc90 10.86,28.7 v10.54,28.7
N$275
  Top 0.152: RN2.1 9.75,42.98 arc-45 9.48,43.09 9,43.58 arc45 8.73,43.69 LED7.A
N$276
  Top 0.152: RN2.2 9.54,42.18 arc-45 9.27,42.3 9.26,42.31 arc45 8.99,42.42 LED6.A
N$277
  Top 0.152: RN2.3 9.54,41.38 arc45 9.27,41.27 9.26,41.26 arc-45 8.99,41.15 LED5.A
N$278
  Top 0.152: RN2.4 9.75,40.58 arc45 9.48,40.47 9,39.99 arc-45 8.73,39.88 LED4.A
N$322
  Top 0.152: 8.37,9.65 LED11.A 8.73,9.71 arc-45 9,9.6 9.48,9.12 arc45 9.75,9.01 RN3.1
N$323
  Top 0.152: RN3.2 9.54,8.21 arc-45 9.27,8.32 9.26,8.33 arc45 8.99,8.45 LED10.A
N$324
  Top 0.152: RN3.3 9.54,7.41 arc45 9.27,7.3 9.26,7.29 arc-45 8.99,7.18 LED9.A
N$325
  Top 0.152: RN3.4 9.75,6.61 arc45 9.48,6.5 9,6.02 arc-45 8.73,5.91 LED8.A
N$369
  Top 0.152: RN4.1 9.75,14.09 arc-45 9.48,14.2 9,14.68 arc45 8.73,14.8 LED15.A
N$370
  Top 0.152: RN4.2 9.54,13.29 arc-45 9.27,13.4 9.26,13.41 arc45 8.99,13.53 LED14.A
N$371
  Top 0.152: RN4.3 9.54,12.49 arc45 9.27,12.38 9.26,12.37 arc-45 8.99,12.26 LED13.A
N$372
  Top 0.152: RN4.4 9.75,11.69 arc45 9.48,11.58 9,11.1 arc-45 8.73,10.99 LED12.A
N_IO0
  Top 0.152: RN1.5 12.24,35.5 arc45 12.6,35.65 13.04,36.09 arc-45 13.39,36.23 PCIE-NORTH.B4
N_IO1
  Top 0.152: RN1.6 12.09,36.3 arc45 12.45,36.45 13.08,37.09 arc-45 13.44,37.23 PCIE-NORTH.B5
N_IO2
  Top 0.152: RN1.7 11.94,37.1 arc45 12.3,37.25 13.13,38.09 arc-45 13.49,38.23 PCIE-NORTH.B6
N_IO3
  Top 0.152: RN1.8 11.79,37.9 arc45 12.14,38.05 13.18,39.09 arc-45 13.54,39.23 PCIE-NORTH.B7
N_IO4
  Top 0.152: RN2.5 12.1,40.58 arc-45 12.46,40.43 12.51,40.38 arc45 12.87,40.23 PCIE-NORTH.B8
N_IO5
  Top 0.152: RN2.6 12.31,41.38 arc-45 12.58,41.27 12.5,41.35 arc45 12.77,41.23 PCIE-NORTH.B9
N_IO6
  Top 0.152: RN2.7 12.56,42.18 arc-45 12.65,42.15 12.83,42.27 arc45 12.92,42.23 PCIE-NORTH.B10
N_IO7
  Top 0.152: RN2.8 12.58,42.98 arc45 12.67,43.02 12.84,43.2 arc-45 12.93,43.23 PCIE-NORTH.B11
N_LVDS_0_N  (via drill 0.25)
  Top 0.152: 3.17,27.18 PMOD2-3.1 3.97,27.18 arc45 4.24,27.29 v4.44,27.5
  Bottom 0.152: PCIE-NORTH.A3 15.46,35.23 arc45 15.19,35.12 15.07,35 arc-45 14.8,34.89 10.3,34.89 arc45 9.85,34.7 8.61,33.46 arc45 8.42,33.01 8.42,29.73 arc-45 8.23,29.28 6.47,27.52 arc-45 6.02,27.33 4.77,27.33 arc-45 4.5,27.44 v4.44,27.5
N_LVDS_0_P
  Bottom 0.152: PCIE-NORTH.A2 15.46,34.23 arc-45 15.19,34.35 15.07,34.47 arc45 14.8,34.58 10.42,34.58 arc45 9.97,34.4 8.91,33.33 arc45 8.72,32.88 8.72,29.6 arc-45 8.54,29.15 6.6,27.21 arc-45 6.15,27.03 4.3,27.03 arc-45 4.12,27.1 4.11,27.1 arc45 3.93,27.18 PMOD2-9.1 3.17,27.18
N_LVDS_1_N  (via drill 0.25)
  Top 0.152: 3.17,29.72 PMOD2-4.1 3.97,29.72 arc45 4.24,29.83 v4.44,30.04
  Bottom 0.152: PCIE-NORTH.A6 15.46,38.23 arc45 15.19,38.12 15.07,38 arc-45 14.8,37.89 9.49,37.89 arc45 9.04,37.7 6.38,35.05 arc45 6.2,34.6 6.2,31.31 arc-45 6.01,30.87 5.2,30.06 arc-45 4.75,29.87 4.77,29.87 arc-45 4.5,29.98 v4.44,30.04
N_LVDS_1_P
  Bottom 0.152: PCIE-NORTH.A5 15.46,37.23 arc-45 15.19,37.35 15.07,37.47 arc45 14.8,37.58 9.61,37.58 arc45 9.16,37.4 6.69,34.92 arc45 6.5,34.47 6.5,31.19 arc-45 6.32,30.74 5.33,29.75 arc-45 4.88,29.57 4.3,29.57 arc-45 4.12,29.64 4.11,29.64 arc45 3.93,29.72 PMOD2-10.1 3.17,29.72
N_LVDS_2_N  (via drill 0.25)
  Top 0.152: v4.44,42.1 4.24,41.89 arc-45 3.97,41.78 PMOD1-1.1
  Bottom 0.152: PCIE-NORTH.A9 15.46,41.23 arc45 15.19,41.12 15.07,41 arc-45 14.8,40.89 10.9,40.89 arc-45 10.45,41.07 9.77,41.75 arc45 9.32,41.94 4.77,41.94 arc-45 4.5,42.05 v4.44,42.1
N_LVDS_2_P
  Bottom 0.152: PCIE-NORTH.A8 15.46,40.23 arc-45 15.19,40.35 15.07,40.47 arc45 14.8,40.58 10.77,40.58 arc-45 10.32,40.77 9.65,41.45 arc45 9.2,41.63 4.3,41.63 arc-45 4.12,41.7 4.11,41.71 arc45 3.93,41.78 PMOD1-7.1 3.17,41.78
N_LVDS_3_N  (via drill 0.25)
  Top 0.152: v4.44,44.64 4.24,44.44 arc-45 3.97,44.32 PMOD1-2.1
  Bottom 0.152: PCIE-NORTH.A14 15.46,48.24 arc45 15.19,48.12 15.07,48 arc-45 14.8,47.89 13.14,47.89 arc45 12.69,47.7 9.65,44.66 arc-45 9.2,44.48 4.77,44.48 arc-45 4.5,44.59 v4.44,44.64
N_LVDS_3_P
  Bottom 0.152: PCIE-NORTH.A13 15.46,47.24 arc-45 15.19,47.35 15.07,47.47 arc45 14.8,47.58 13.26,47.58 arc45 12.81,47.4 9.77,44.36 arc-45 9.32,44.17 4.3,44.17 arc-45 4.12,44.25 4.11,44.25 arc45 3.93,44.32 PMOD1-8.1 3.17,44.32
N_LVDS_4_N  (via drill 0.25)
  Top 0.152: 3.17,46.86 PMOD1-3.1 3.97,46.86 arc45 4.24,46.98 v4.44,47.18
  Bottom 0.152: PCIE-NORTH.A17 15.46,51.24 arc45 15.19,51.12 15.07,51 arc-45 14.8,50.89 12.33,50.89 arc45 11.88,50.7 8.38,47.2 arc-45 7.93,47.02 4.77,47.02 arc-45 4.5,47.13 v4.44,47.18
N_LVDS_4_P
  Bottom 0.152: PCIE-NORTH.A16 15.46,50.24 arc-45 15.19,50.35 15.07,50.47 arc45 14.8,50.58 12.45,50.58 arc45 12,50.4 8.5,46.9 arc-45 8.05,46.71 4.3,46.71 arc-45 4.12,46.78 4.11,46.79 arc45 3.93,46.86 PMOD1-9.1 3.17,46.86
N_LVDS_5_N
  Top 0.152: PCIE-NORTH.B17 15.46,51.09 arc45 15.19,50.97 15.07,50.85 arc-45 14.8,50.74 5.95,50.74 arc45 5.5,50.55 4.62,49.67 arc-45 4.35,49.55 4.3,49.55 arc45 4.12,49.48 4.11,49.48 arc-45 3.93,49.4 PMOD1-4.1 3.17,49.4
N_LVDS_5_P  (via drill 0.25)
  Top 0.152: PCIE-NORTH.B16 15.46,50.09 arc-45 15.19,50.2 15.07,50.32 arc45 14.8,50.43 6.08,50.43 arc45 5.63,50.25 4.51,49.12 4.48,49.12 v4.44,49.09
  Bottom 0.152: 3.17,49.4 PMOD1-10.1 3.97,49.4 arc-45 4.24,49.29 v4.44,49.09
PCIE_N_V  (via drill 0.33, 0.41)
  Top 0.203: R1.1 12.38,45.91 12.38,47.24
  Top 0.61: PCIE-NORTH.B13 12.38,47.24 7.29,47.24 C1.1
  Top 0.762: C1.1 v6.03,48.77 | PMOD1-6.1 v4.44,54.48 | v4.44,34.8 PMOD2-12.1
  Route2 0.762: v6.03,48.77 6.03,34.8 v4.44,34.8
  Route15 0.762: v6.03,48.77 6.03,54.48 v4.44,54.48
  Bottom 0.762: v4.44,54.48 PMOD1-6.1 | PMOD2-12.1 v4.44,34.8
PCIE_S_V  (via drill 0.33, 0.41)
  Top 0.203: R2.1 12.38,17.34 12.38,18.66
  Top 0.61: PCIE-SOUTH.B13 12.38,18.66 7.29,18.66 C2.1
  Top 0.762: C2.1 v6.03,20.19 | PMOD3-12.1 v4.44,15.11
  Route2 0.762: v6.03,20.19 6.03,15.11 v4.44,15.11
  Bottom 0.762: PMOD3-12.1 v4.44,15.11
S_IO0
  Top 0.152: RN3.5 12.24,6.61 arc45 12.6,6.76 13.35,7.51 arc-45 13.71,7.66 PCIE-SOUTH.B4
S_IO1
  Top 0.152: RN3.6 12.09,7.41 arc45 12.45,7.56 13.4,8.51 arc-45 13.76,8.66 PCIE-SOUTH.B5
S_IO2
  Top 0.152: RN3.7 11.94,8.21 arc45 12.3,8.36 13.45,9.51 arc-45 13.81,9.66 PCIE-SOUTH.B6
S_IO3
  Top 0.152: RN3.8 11.79,9.01 arc45 12.14,9.16 13.5,10.51 arc-45 13.85,10.66 PCIE-SOUTH.B7
S_IO4
  Top 0.152: PCIE-SOUTH.B8 11.5,11.66 RN4.5
S_IO5
  Top 0.152: RN4.6 12.56,12.49 arc45 12.65,12.53 12.75,12.62 arc-45 12.84,12.66 PCIE-SOUTH.B9
S_IO6
  Top 0.152: RN4.7 12.31,13.29 arc45 12.58,13.4 12.72,13.55 arc-45 12.99,13.66 PCIE-SOUTH.B10
S_IO7
  Top 0.152: RN4.8 12.1,14.09 arc45 12.46,14.24 12.73,14.51 arc-45 13.09,14.66 PCIE-SOUTH.B11
S_LVDS_0_N  (via drill 0.25)
  Top 0.152: PMOD3-1.1 3.97,2.41 arc45 4.24,2.53 v4.44,2.73
  Bottom 0.152: PCIE-SOUTH.A3 15.46,6.66 arc45 15.19,6.55 15.07,6.42 arc-45 14.8,6.31 12.84,6.31 arc45 12.39,6.13 9.01,2.75 arc-45 8.56,2.57 4.77,2.57 arc-45 4.5,2.68 v4.44,2.73
S_LVDS_0_P
  Bottom 0.152: PCIE-SOUTH.A2 15.46,5.66 arc-45 15.19,5.77 15.07,5.9 arc45 14.8,6.01 12.96,6.01 arc45 12.51,5.82 9.14,2.45 arc-45 8.69,2.26 4.3,2.26 arc-45 4.12,2.34 4.11,2.34 arc45 3.93,2.41 PMOD3-7.1 3.17,2.41
S_LVDS_1_N  (via drill 0.25)
  Top 0.152: PMOD3-2.1 3.97,4.95 arc45 4.24,5.07 v4.44,5.27
  Bottom 0.152: PCIE-SOUTH.A6 15.46,9.66 arc45 15.19,9.55 15.07,9.42 arc-45 14.8,9.31 12.03,9.31 arc45 11.58,9.13 7.74,5.29 arc-45 7.29,5.11 4.77,5.11 arc-45 4.5,5.22 v4.44,5.27
S_LVDS_1_P
  Bottom 0.152: PCIE-SOUTH.A5 15.46,8.66 arc-45 15.19,8.77 15.07,8.9 arc45 14.8,9.01 12.15,9.01 arc45 11.71,8.82 7.87,4.99 arc-45 7.42,4.8 4.3,4.8 arc-45 4.12,4.88 4.11,4.88 arc45 3.93,4.95 PMOD3-8.1 3.17,4.95
S_LVDS_2_N  (via drill 0.25)
  Top 0.152: 3.17,7.49 PMOD3-3.1 3.97,7.49 arc45 4.24,7.61 v4.44,7.81
  Bottom 0.152: PCIE-SOUTH.A9 15.46,12.66 arc45 15.19,12.55 15.07,12.42 arc-45 14.8,12.31 11.22,12.31 arc45 10.77,12.13 6.47,7.83 arc-45 6.02,7.64 4.77,7.64 arc-45 4.5,7.76 v4.44,7.81
S_LVDS_2_P
  Bottom 0.152: PCIE-SOUTH.A8 15.46,11.66 arc-45 15.19,11.77 15.07,11.9 arc45 14.8,12.01 11.34,12.01 arc45 10.89,11.82 6.6,7.53 arc-45 6.15,7.34 4.3,7.34 arc-45 4.12,7.41 4.11,7.42 arc45 3.93,7.49 PMOD3-9.1 3.17,7.49
S_LVDS_3_N  (via drill 0.25)
  Top 0.152: 3.17,10.03 PMOD3-4.1 3.97,10.03 arc45 4.24,10.14 v4.44,10.35
  Bottom 0.152: PCIE-SOUTH.A14 15.46,19.66 arc45 15.19,19.55 15.07,19.42 arc-45 14.8,19.31 10.6,19.31 arc45 10.15,19.13 6.38,15.36 arc45 6.2,14.91 6.2,11.63 arc-45 6.01,11.18 5.2,10.37 arc-45 4.75,10.18 4.77,10.18 arc-45 4.5,10.3 v4.44,10.35
S_LVDS_3_P
  Bottom 0.152: PCIE-SOUTH.A13 15.46,18.66 arc-45 15.19,18.77 15.07,18.9 arc45 14.8,19.01 10.72,19.01 arc45 10.27,18.82 6.69,15.24 arc45 6.5,14.79 6.5,11.5 arc-45 6.32,11.05 5.33,10.07 arc-45 4.88,9.88 4.3,9.88 arc-45 4.12,9.96 4.11,9.96 arc45 3.93,10.03 PMOD3-10.1 3.17,10.03
S_LVDS_4_N  (via drill 0.25)
  Top 0.152: v4.44,24.96 4.24,24.75 arc-45 3.97,24.64 PMOD2-2.1
  Bottom 0.152: PCIE-SOUTH.A17 15.46,22.66 arc45 15.19,22.55 15.07,22.42 arc-45 14.8,22.31 10.42,22.31 arc-45 9.97,22.5 7.87,24.6 arc45 7.42,24.79 4.77,24.79 arc-45 4.5,24.9 v4.44,24.96
S_LVDS_4_P
  Bottom 0.152: PCIE-SOUTH.A16 15.46,21.66 arc-45 15.19,21.77 15.07,21.9 arc45 14.8,22.01 10.3,22.01 arc-45 9.85,22.19 7.74,24.3 arc45 7.29,24.49 4.3,24.49 arc-45 4.12,24.56 4.11,24.56 arc45 3.93,24.64 PMOD2-8.1 3.17,24.64
S_LVDS_5_N
  Top 0.152: PCIE-SOUTH.B17 15.46,22.66 arc45 15.19,22.55 15.07,22.42 arc-45 14.8,22.31 4.25,22.31 4.04,22.1 PMOD2-1.1
S_LVDS_5_P  (via drill 0.25)
  Top 0.152: PCIE-SOUTH.B16 15.46,21.66 arc-45 15.19,21.77 15.07,21.9 arc45 14.8,22.01 4.68,22.01 v4.44,21.77
  Bottom 0.152: 3.17,22.1 PMOD2-7.1 3.96,22.1 arc-45 4.23,21.99 v4.44,21.77
SCL
  Top 0.152: U1.6 11.05,33.73 arc-90 11.56,34.23 PCIE-NORTH.B2
SDA
  Top 0.152: U1.5 11.55,33.7 arc-90 11.78,33.93 14.19,33.93 arc-45 14.46,33.81 14.93,33.35 arc45 15.2,33.23 PCIE-NORTH.B1

### Text on the board
tDocu: HIGH SPEED IO
_bSilk: V1.2 / R1.0 | Triple PMOD / Dual Plugin Module | Copyright (C) 2015 Herbert Pötzl / Licensed under CERN OHL v.1.2
tEngrave: AXIOM BETA DPM 3xPMOD / TOP SIDE V1.2 R1.0
bEngrave: AXIOM BETA DPM 3xPMOD / BOTTOM SIDE V1.2 R1.0